# EAGLE schematic M205A (EAGLE 6.6.0)
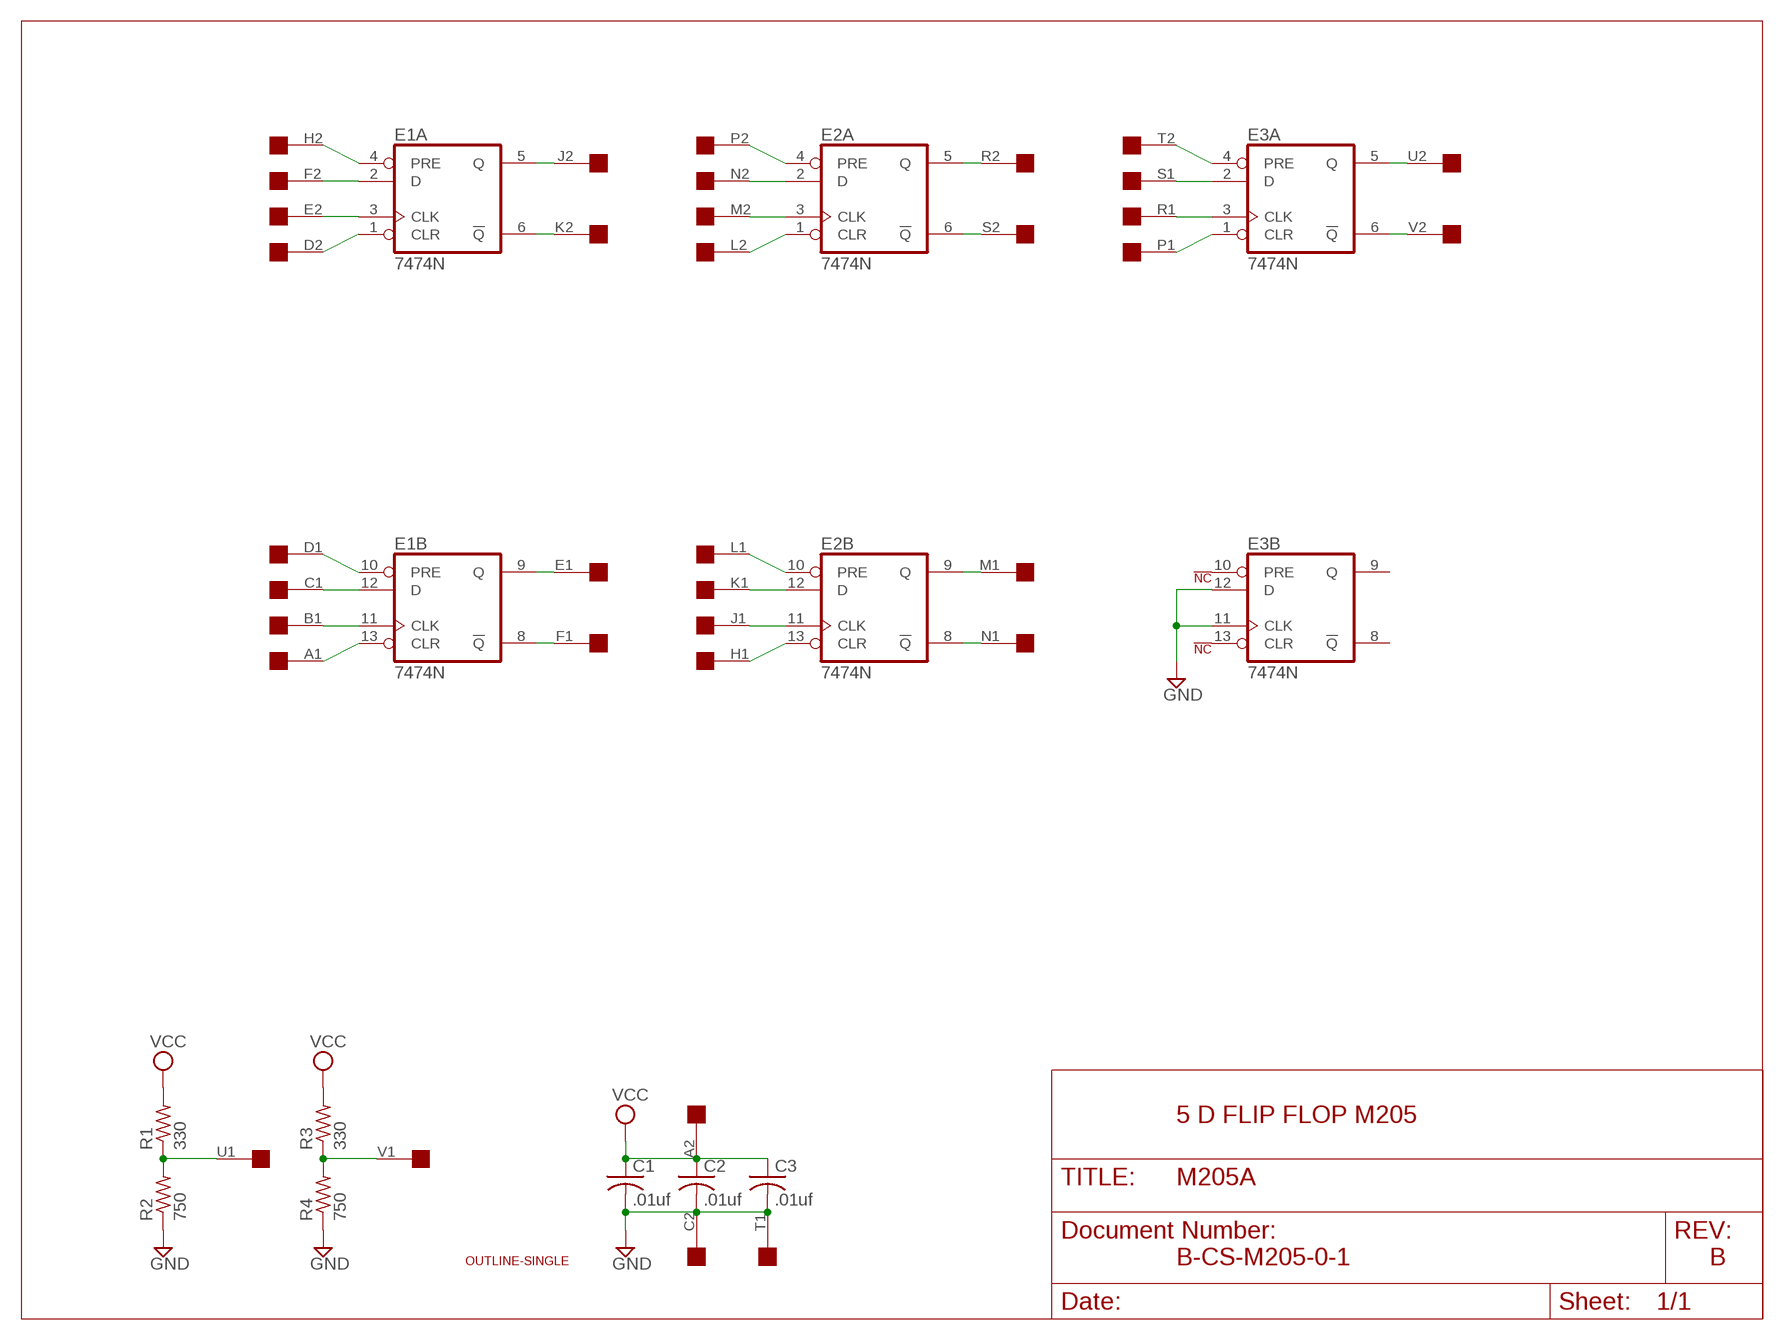
[diagram p0: schematic, sheet 1]

## Parts
C1  .01uf  C-US050-025X075  [C050-025X075]
C2  .01uf  C-US050-025X075  [C050-025X075]
C3  .01uf  C-US050-025X075  [C050-025X075]
E1  7474N  74S74N  [DIL14]
E2  7474N  74S74N  [DIL14]
E3  7474N  74S74N  [DIL14]
R1  330  R-US_0207/10  [0207/10]
R2  750  R-US_0207/10  [0207/10]
R3  330  R-US_0207/10  [0207/10]
R4  750  R-US_0207/10  [0207/10]
U$1  OUTLINE-SINGLE  [SINGLE]
U$2  EDGE-2CONNECTOR  [EDGE-CON2]

## Nets
GND [Supply]: C1.2 C2.2 C3.2 E3.11(B:CLK) E3.12(B:D) R2.1 R4.1 U$2.C2 U$2.T1
N$1: R1.1 R2.2 U$2.U1
N$2: R3.1 R4.2 U$2.V1
N$3: E1.6(A:!Q) U$2.K2
N$4: E1.5(A:Q) U$2.J2
N$5: E1.2(A:D) U$2.F2
N$6: E1.4(A:PRE) U$2.H2
N$7: E1.3(A:CLK) U$2.E2
N$8: E1.1(A:CLR) U$2.D2
N$9: E2.1(A:CLR) U$2.L2
N$10: E2.3(A:CLK) U$2.M2
N$11: E2.2(A:D) U$2.N2
N$12: E2.4(A:PRE) U$2.P2
N$13: E2.6(A:!Q) U$2.S2
N$14: E2.5(A:Q) U$2.R2
N$15: E3.1(A:CLR) U$2.P1
N$16: E3.3(A:CLK) U$2.R1
N$17: E3.2(A:D) U$2.S1
N$18: E3.6(A:!Q) U$2.V2
N$19: E3.5(A:Q) U$2.U2
N$20: E3.4(A:PRE) U$2.T2
N$21: E1.13(B:CLR) U$2.A1
N$22: E1.11(B:CLK) U$2.B1
N$23: E1.10(B:PRE) U$2.D1
N$24: E1.8(B:!Q) U$2.F1
N$25: E1.9(B:Q) U$2.E1
N$26: E1.12(B:D) U$2.C1
N$27: E2.13(B:CLR) U$2.H1
N$28: E2.11(B:CLK) U$2.J1
N$29: E2.12(B:D) U$2.K1
N$30: E2.10(B:PRE) U$2.L1
N$31: E2.9(B:Q) U$2.M1
N$32: E2.8(B:!Q) U$2.N1
NC: E3.10(B:PRE) E3.13(B:CLR)
VCC [Supply]: C1.1 C2.1 C3.1 R1.2 R3.2 U$2.A2
Unconnected: E3.8(B:!Q) E3.9(B:Q) U$2.B2

## Notes on the sheet
- 5 D FLIP FLOP M205
- B-CS-M205-0-1 | B

## Power pins joined to a net without a drawn wire
GND: E1.7(P:GND) E2.7(P:GND) E3.7(P:GND)
VCC: E1.14(P:VCC) E2.14(P:VCC) E3.14(P:VCC)

## Library data of the parts
C1-C3 = rcl:C-US: CAPACITOR, American symbol
E1-E3 = 74xx-us:74*74: Dual D type positive edge triggered FLIP FLOP, preset and clear
R1-R4 = rcl:R-US_: RESISTOR, American symbol
U$1 = dec-con:OUTLINE-*: Board outlines for DEC boards.
U$2 = dec-con:EDGE-2: Double-Sided DEC edge connector.

## Net classes
1 Supply: width 0.813 mm